# EasyEDA schematic Sheet_1.json
TITLE: Sheet_1; REV: 1.0; Date: 2023-12-06; Sheet: 1/1; Drawn By: ouy_qaq; Company: Your Company
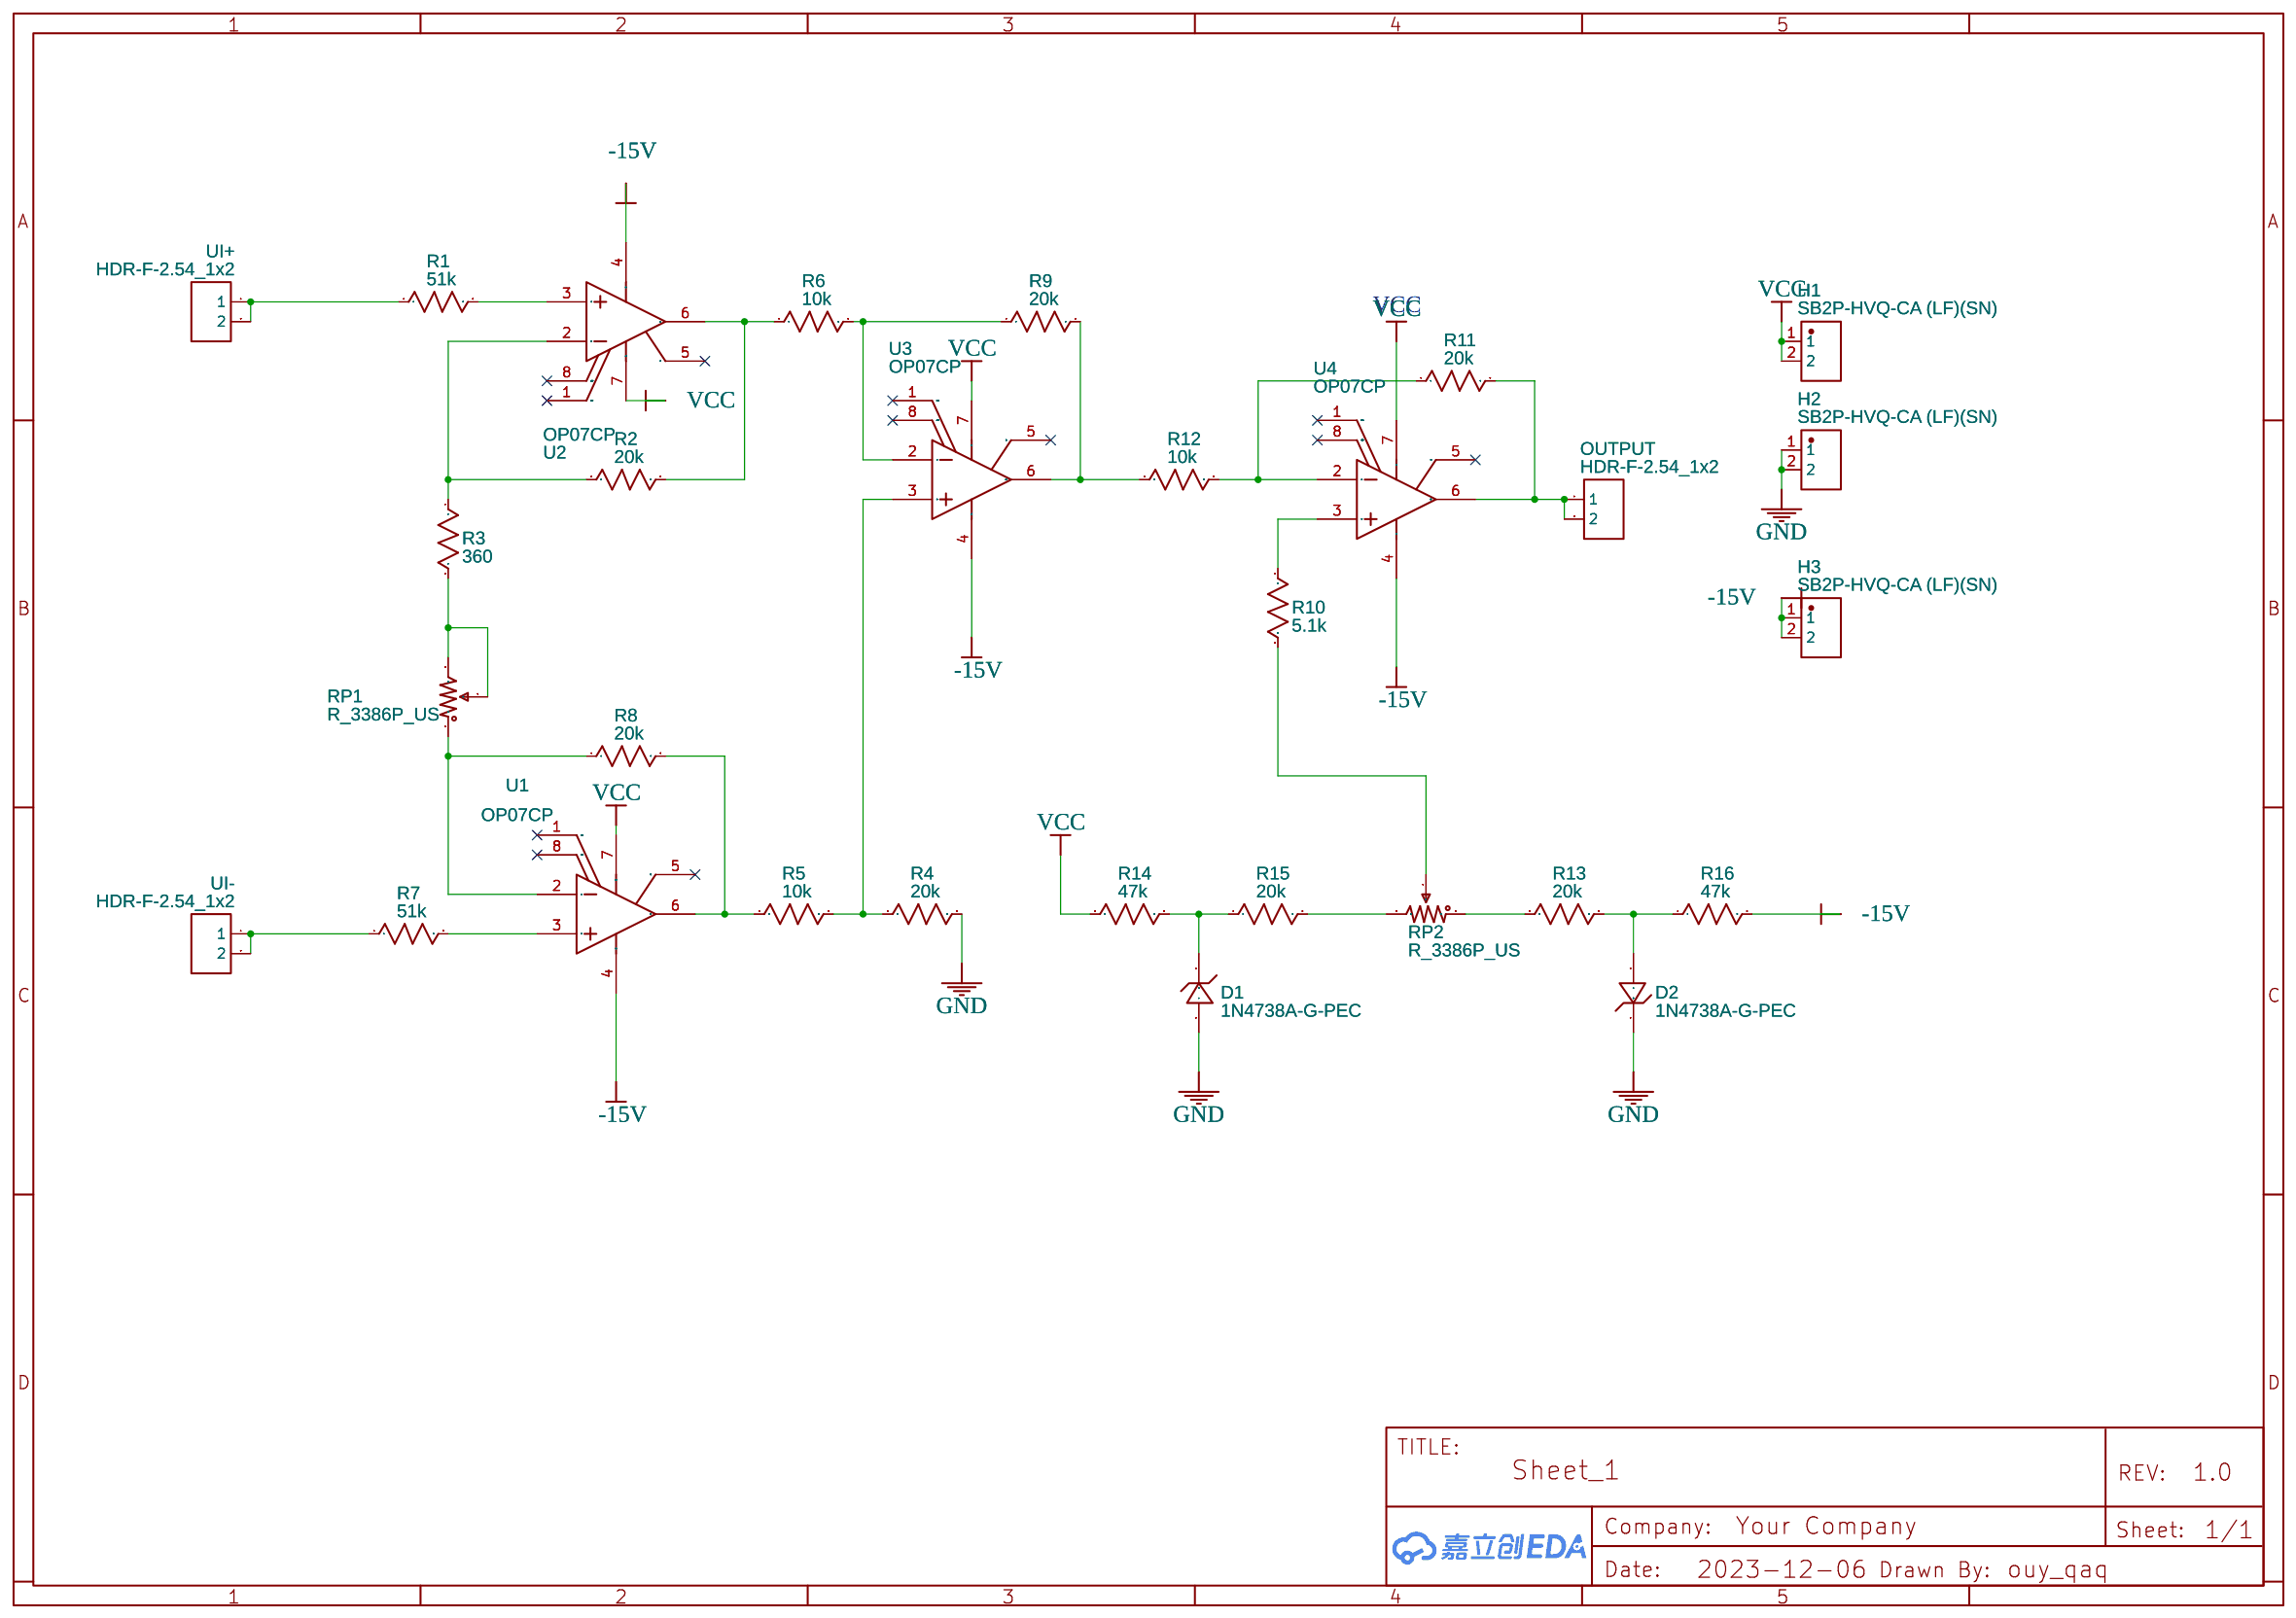
[diagram p0: schematic sheet]

## Parts
D1  1N4738A-G-PEC  [DO-41G_BD2.4-L4.0-P8.00-D0.7-RD]
D2  1N4738A-G-PEC  [DO-41G_BD2.4-L4.0-P8.00-D0.7-RD]
H1  SB2P-HVQ-CA (LF)(SN)  [HDR-TH_2P-P2.54-V-M-1]
H2  SB2P-HVQ-CA (LF)(SN)  [HDR-TH_2P-P2.54-V-M-1]
H3  SB2P-HVQ-CA (LF)(SN)  [HDR-TH_2P-P2.54-V-M-1]
OUTPUT  HDR-F-2.54_1x2  [HDR-F-2.54_1X2]
R1  51k  [R_AXIAL-0.3]
R2  20k  [R_AXIAL-0.3]
R3  360  [R_AXIAL-0.3]
R4  20k  [R_AXIAL-0.3]
R5  10k  [R_AXIAL-0.3]
R6  10k  [R_AXIAL-0.3]
R7  51k  [R_AXIAL-0.3]
R8  20k  [R_AXIAL-0.3]
R9  20k  [R_AXIAL-0.3]
R10  5.1k  [R_AXIAL-0.3]
R11  20k  [R_AXIAL-0.3]
R12  10k  [R_AXIAL-0.3]
R13  20k  [R_AXIAL-0.3]
R14  47k  [R_AXIAL-0.3]
R15  20k  [R_AXIAL-0.3]
R16  47k  [R_AXIAL-0.3]
RP1  R_3386P_US  [RES-ADJ-TH_3P-L10.0-W10.0-P2.50-BL-BS]
RP2  R_3386P_US  [RES-ADJ-TH_3P-L10.0-W10.0-P2.50-BL-BS]
U1  OP07CP  [DIP-8_L9.6-W6.4-P2.54-LS7.6-BL-1]
U2  OP07CP  [DIP-8_L9.6-W6.4-P2.54-LS7.6-BL-1]
U3  OP07CP  [DIP-8_L9.6-W6.4-P2.54-LS7.6-BL-1]
U4  OP07CP  [DIP-8_L9.6-W6.4-P2.54-LS7.6-BL-1]
UI+  HDR-F-2.54_1x2  [HDR-F-2.54_1X2]
UI-  HDR-F-2.54_1x2  [HDR-F-2.54_1X2]

## Library data of the parts
D1 D2 = 1N4738A-G-PEC: Contributor: LCSC; Supplier: LCSC; Supplier Part: C263132; Manufacturer: PANJIT(强茂); Manufacturer Part: 1N4738A-G_AY_10001; JLCPCB Part Class: Extended Part
H1-H3 = SB2P-HVQ-CA (LF)(SN): Contributor: LCSC; Supplier: LCSC; Supplier Part: C157909; Manufacturer: JST; JLCPCB Part Class: Extended Part
OUTPUT UI+ UI- = HDR-F-2.54_1x2: Supplier Part: C49661; Supplier: LCSC; Contributor: LCEDA_Lib
R1-R16 = R_0603_US: Contributor: LCEDA_Lib
RP1 RP2 = R_3386P_US: Supplier: LCSC; Contributor: LCEDA_Lib; value(Ω): 10K
U1-U4 = OP07CP: Supplier: LCSC; Manufacturer: TI(德州仪器); Supplier Part: C5224; JLCPCB Part Class: Extended Part

## Nets
-15V: H3.1 H3.2 R16.2 U1.4(VCC-) U2.4(VCC-) U3.4(VCC-) U4.4(VCC-)
GND: D1.2(A) D2.1(C) H2.1 H2.2 R4.2
VCC: H1.1 H1.2 R14.1 U1.7(VCC+) U2.7(VCC+) U3.7(VCC+) U4.7(VCC+)
Net-(D1-1): D1.1(C) R14.2 R15.1
Net-(D2-2): D2.2(A) R13.2 R16.1
Net-(OUTPUT-1): OUTPUT.1 OUTPUT.2 R11.2 U4.6(OUT)
Net-(R1-1): R1.1 UI+.1 UI+.2
Net-(R1-2): R1.2 U2.3(IN+)
Net-(R2-1): R2.1 R3.1 U2.2(IN-)
Net-(R2-2): R2.2 R6.1 U2.6(OUT)
Net-(R3-2): R3.2 RP1.2 RP1.3
Net-(R4-1): R4.1 R5.2 U3.3(IN+)
Net-(R5-1): R5.1 R8.2 U1.6(OUT)
Net-(R6-2): R6.2 R9.1 U3.2(IN-)
Net-(R7-1): R7.1 UI-.1 UI-.2
Net-(R7-2): R7.2 U1.3(IN+)
Net-(R8-1): R8.1 RP1.1 U1.2(IN-)
Net-(R9-2): R9.2 R12.1 U3.6(OUT)
Net-(R10-1): R10.1 U4.3(IN+)
Net-(R10-2): R10.2 RP2.2
Net-(R11-1): R11.1 R12.2 U4.2(IN-)
Net-(R13-1): R13.1 RP2.1
Net-(R15-2): R15.2 RP2.3

Not connected (* = marked no-connect by the designer): U1 1(OFFSET_N1)* 5(NC)* 8(OFFSET_N2)*; U2 1(OFFSET_N1)* 5(NC)* 8(OFFSET_N2)*; U3 1(OFFSET_N1)* 5(NC)* 8(OFFSET_N2)*; U4 1(OFFSET_N1)* 5(NC)* 8(OFFSET_N2)*

## Notes on the sheet
- VCC
